# Altium schematic sheet Clock.SchDoc: Clocks
size A4; Author: Carlos Barreiro; Organization: Escuela Técnica Superior de Ingeniería de Sistemas Informáticos de la Universidad Politécnica de Madrid; Address1: Campus Sur de la Universidad Politécnica de Madrid; Address2: Calle de Alan Turing, s/nº; Address3: Madrid 28031; Address4: España; DocumentNumber: 12; Revision: A; SheetNumber: 12; SheetTotal: 16
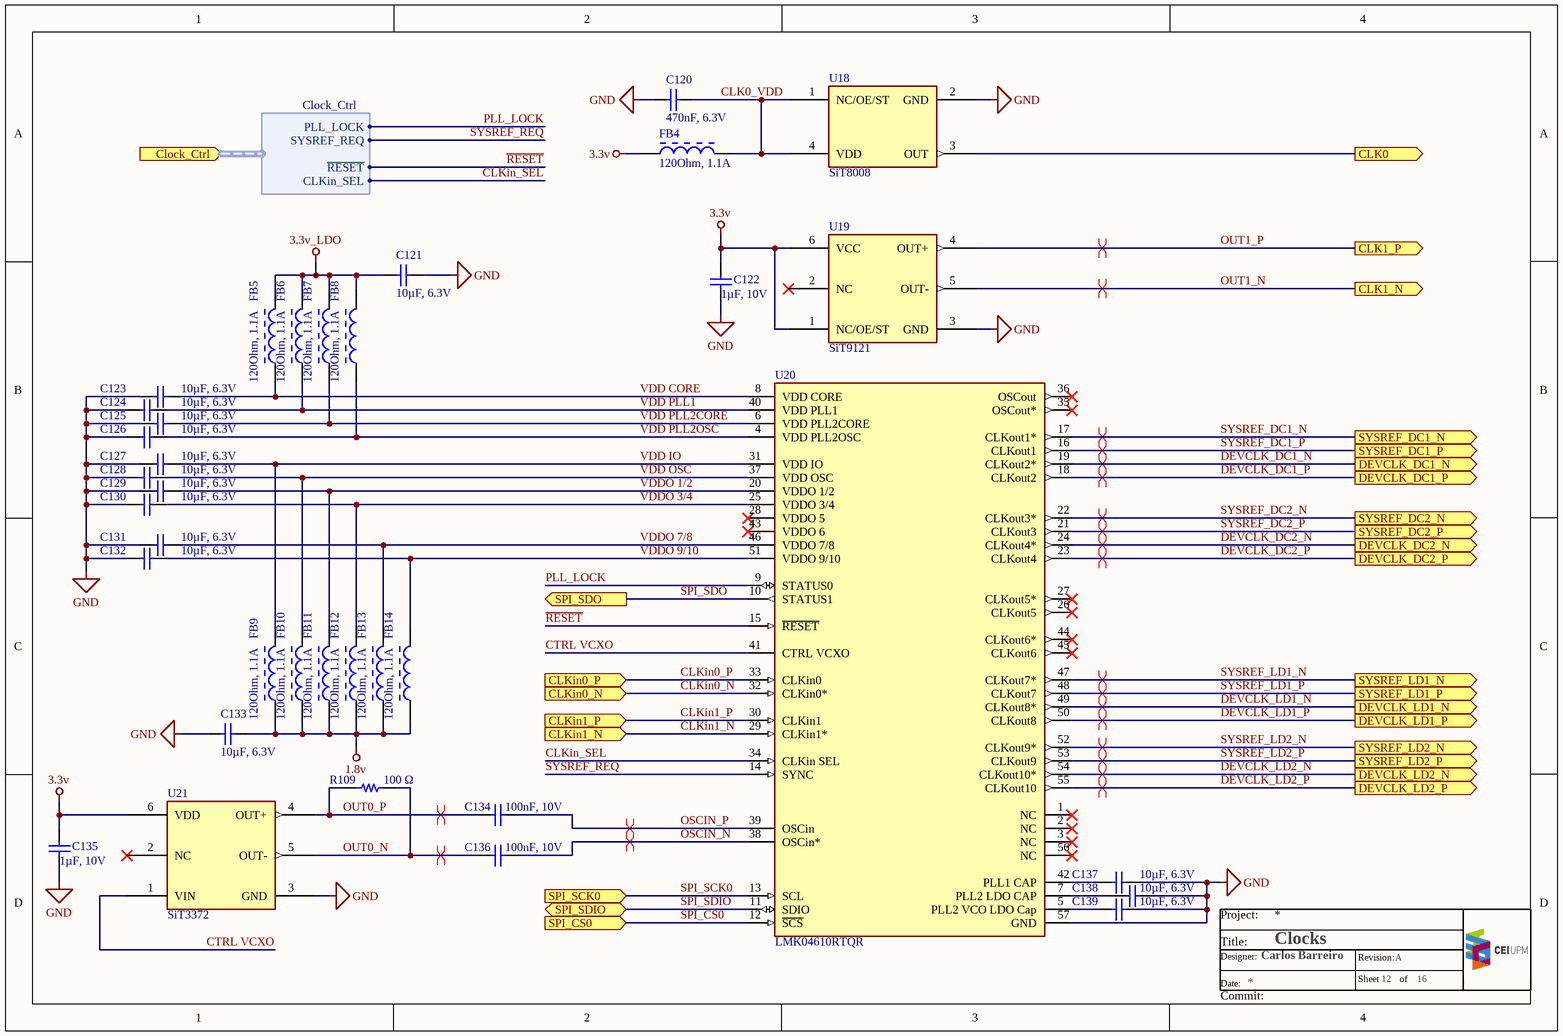
[diagram p0: Clock.SchDoc]

## Parts
C120  470nF, 6.3V  [WURTH_WCAP-CSGP_0402]
C121  10µF, 6.3V  [WURTH_WCAP-CSGP_0402]
C122  1µF, 10V  [WURTH_WCAP-CSGP_0402]
C123  10µF, 6.3V  [WURTH_WCAP-CSGP_0402]
C124  10µF, 6.3V  [WURTH_WCAP-CSGP_0402]
C125  10µF, 6.3V  [WURTH_WCAP-CSGP_0402]
C126  10µF, 6.3V  [WURTH_WCAP-CSGP_0402]
C127  10µF, 6.3V  [WURTH_WCAP-CSGP_0402]
C128  10µF, 6.3V  [WURTH_WCAP-CSGP_0402]
C129  10µF, 6.3V  [WURTH_WCAP-CSGP_0402]
C130  10µF, 6.3V  [WURTH_WCAP-CSGP_0402]
C131  10µF, 6.3V  [WURTH_WCAP-CSGP_0402]
C132  10µF, 6.3V  [WURTH_WCAP-CSGP_0402]
C133  10µF, 6.3V  [WURTH_WCAP-CSGP_0402]
C134  100nF, 10V  [WURTH_WCAP-CSGP_0402]
C135  1µF, 10V  [WURTH_WCAP-CSGP_0402]
C136  100nF, 10V  [WURTH_WCAP-CSGP_0402]
C137  10µF, 6.3V  [WURTH_WCAP-CSGP_0402]
C138  10µF, 6.3V  [WURTH_WCAP-CSGP_0402]
C139  10µF, 6.3V  [WURTH_WCAP-CSGP_0402]
FB4  120Ohm, 1.1A  [WURTH-CBF_0402]
FB5  120Ohm, 1.1A  [WURTH-CBF_0402]
FB6  120Ohm, 1.1A  [WURTH-CBF_0402]
FB7  120Ohm, 1.1A  [WURTH-CBF_0402]
FB8  120Ohm, 1.1A  [WURTH-CBF_0402]
FB9  120Ohm, 1.1A  [WURTH-CBF_0402]
FB10  120Ohm, 1.1A  [WURTH-CBF_0402]
FB11  120Ohm, 1.1A  [WURTH-CBF_0402]
FB12  120Ohm, 1.1A  [WURTH-CBF_0402]
FB13  120Ohm, 1.1A  [WURTH-CBF_0402]
FB14  120Ohm, 1.1A  [WURTH-CBF_0402]
R109  100 Ω  [PANASONIC_ERJ2G_0402]
U18  SiT8008  [SiTime_5032_4]
U19  SiT9121  [SiTime_5032_6]
U20  LMK04610RTQR  [TEXAS_VQFN56]
U21  SiT3372  [SiTime_5032_6]

## Ports
CLK0 (out), CLK1_N (out), CLK1_P (out), CLKin0_N (in), CLKin0_P (in), CLKin1_N (in), CLKin1_P (in), Clock_Ctrl (in, harness Clock_Ctrl), DEVCLK_DC1_N (out), DEVCLK_DC1_P (out), DEVCLK_DC2_N (out), DEVCLK_DC2_P (out), DEVCLK_LD1_N (out), DEVCLK_LD1_P (out), DEVCLK_LD2_N (out), DEVCLK_LD2_P (out), SPI_CS0 (in), SPI_SCK0 (in), SPI_SDIO (bidir), SPI_SDO (out), SYSREF_DC1_N (out), SYSREF_DC1_P (out), SYSREF_DC2_N (out), SYSREF_DC2_P (out), SYSREF_LD1_N (out), SYSREF_LD1_P (out), SYSREF_LD2_N (out), SYSREF_LD2_P (out)

## Harnesses
Clock_Ctrl: PLL_LOCK, SYSREF_REQ, ~{RESET}, CLKin_SEL

## Nets
1.8v: C133.2 FB9.2 FB10.2 FB11.2 FB12.2 FB13.2 FB14.2
3.3v: C122.2 C135.2 FB4.2 U19.1(NC/OE/ST) U19.6(VCC) U21.6(VDD)
3.3v_LDO: C121.1 FB5.1 FB6.1 FB7.1 FB8.1
GND: C120.1 C121.2 C122.1 C123.1 C124.1 C125.1 C126.1 C127.1 C128.1 C129.1 C130.1 C131.1 C132.1 C133.1 C135.1 C137.2 C138.2 C139.2 U18.2(GND) U19.3(GND) U20.57(GND) U21.3(GND)
CLK0: U18.3(OUT) ; port CLK0
CLK0_VDD: C120.2 FB4.1 U18.1(NC/OE/ST) U18.4(VDD)
CLKin0_N: U20.32(CLKin0*) ; port CLKin0_N
CLKin0_P: U20.33(CLKin0) ; port CLKin0_P
CLKin1_N: U20.29(CLKin1*) ; port CLKin1_N
CLKin1_P: U20.30(CLKin1) ; port CLKin1_P
CLKin_SEL: U20.34(CLKin_SEL) ; port Clock_Ctrl.CLKin_SEL
CTRL VCXO: U20.41(CTRL_VCXO) U21.1(VIN)
DEVCLK_DC1_N: U20.19(CLKout2*) ; port DEVCLK_DC1_N
DEVCLK_DC1_P: U20.18(CLKout2) ; port DEVCLK_DC1_P
DEVCLK_DC2_N: U20.24(CLKout4*) ; port DEVCLK_DC2_N
DEVCLK_DC2_P: U20.23(CLKout4) ; port DEVCLK_DC2_P
DEVCLK_LD1_N: U20.49(CLKout8*) ; port DEVCLK_LD1_N
DEVCLK_LD1_P: U20.50(CLKout8) ; port DEVCLK_LD1_P
DEVCLK_LD2_N: U20.54(CLKout10*) ; port DEVCLK_LD2_N
DEVCLK_LD2_P: U20.55(CLKout10) ; port DEVCLK_LD2_P
OSCIN_N: C136.2 U20.38(OSCin*)
OSCIN_P: C134.2 U20.39(OSCin)
OUT0_N: C136.1 R109.2 U21.5(OUT-)
OUT0_P: C134.1 R109.1 U21.4(OUT+)
OUT1_N: U19.5(OUT-) ; port CLK1_N
OUT1_P: U19.4(OUT+) ; port CLK1_P
PLL_LOCK: U20.9(STATUS0) ; port Clock_Ctrl.PLL_LOCK
~{RESET}: U20.15(~{RESET}) ; port Clock_Ctrl.~{RESET}
SPI_CS0: U20.12(~{SCS}) ; port SPI_CS0
SPI_SCK0: U20.13(SCL) ; port SPI_SCK0
SPI_SDIO: U20.11(SDIO) ; port SPI_SDIO
SPI_SDO: U20.10(STATUS1) ; port SPI_SDO
SYSREF_DC1_N: U20.17(CLKout1*) ; port SYSREF_DC1_N
SYSREF_DC1_P: U20.16(CLKout1) ; port SYSREF_DC1_P
SYSREF_DC2_N: U20.22(CLKout3*) ; port SYSREF_DC2_N
SYSREF_DC2_P: U20.21(CLKout3) ; port SYSREF_DC2_P
SYSREF_LD1_N: U20.47(CLKout7*) ; port SYSREF_LD1_N
SYSREF_LD1_P: U20.48(CLKout7) ; port SYSREF_LD1_P
SYSREF_LD2_N: U20.52(CLKout9*) ; port SYSREF_LD2_N
SYSREF_LD2_P: U20.53(CLKout9) ; port SYSREF_LD2_P
SYSREF_REQ: U20.14(SYNC) ; port Clock_Ctrl.SYSREF_REQ
VDD CORE: C123.2 FB5.2 U20.8(VDD_CORE)
VDD IO: C127.2 FB9.1 U20.31(VDD_IO)
VDD OSC: C128.2 FB10.1 U20.37(VDD_OSC)
VDD PLL1: C124.2 FB6.2 U20.40(VDD_PLL1)
VDD PLL2CORE: C125.2 FB7.2 U20.6(VDD_PLL2CORE)
VDD PLL2OSC: C126.2 FB8.2 U20.4(VDD_PLL2OSC)
VDDO 1/2: C129.2 FB11.1 U20.20(VDDO_1/2)
VDDO 3/4: C130.2 FB12.1 U20.25(VDDO_3/4)
VDDO 7/8: C131.2 FB13.1 U20.46(VDDO_7/8)
VDDO 9/10: C132.2 FB14.1 U20.51(VDDO_9/10)
NetC137_1: C137.1 U20.42(PLL1_CAP)
NetC138_1: C138.1 U20.7(PLL2_LDO_CAP)
NetC139_1: C139.1 U20.5(PLL2_VCO_LDO_Cap)

Not connected (* = marked no-connect by the designer): U19 2(NC)*; U20 1(NC)* 2(NC)* 3(NC)* 26(CLKout5)* 27(CLKout5*)* 28(VDDO_5)* 35(OSCout*)* 36(OSCout)* 43(VDDO_6)* 44(CLKout6*)* 45(CLKout6)* 56(NC)*; U21 2(NC)*

## Layout directives
differential pair: DEVCLK_DC1_N, DEVCLK_DC1_P, DEVCLK_DC2_N, DEVCLK_DC2_P, DEVCLK_LD1_N, DEVCLK_LD1_P, DEVCLK_LD2_N, DEVCLK_LD2_P, OSCIN_N, OSCIN_P, OUT0_N, OUT0_P, OUT1_N, OUT1_P, SYSREF_DC1_N, SYSREF_DC1_P, SYSREF_DC2_N, SYSREF_DC2_P, SYSREF_LD1_N, SYSREF_LD1_P, SYSREF_LD2_N, SYSREF_LD2_P

## Notes on the sheet
- Project:
- Title:
- Date:
- Designer:
- Sheet
- Revision:
- of
- Commit:

## Library data of the parts
C120 = 885012105004: WCAP-CSGP Multilayer Ceramic Chip Capacitor, General Purpose, size 0402, X5R, 470nF, 6.3V; Manufacturer: Wurth Elektronik; Rated Voltage: 6.3VDC; Isolation Resistance  min.: 0.2GOhm; Capacitance Tolerance: +/-20%; Dissipation Factor max.: 10%; Technical Reference: X5R0402474M6R3DFCT10000; ComponentLink1Description: Manufacturer; ComponentLink1URL: http://www.we-online.de; ComponentLink2Description: Datasheet; ComponentLink2URL: https://www.we-online.com/catalog/datasheet/885012105004.pdf; Operating Temperature: -55 to +85degC; Packaging: Tape and Reel; Manufacturer Part Number: 885012105004; Published Date: April 2021; Ceramic Type: X5R; Height: 0.5mm; Mounting Technology: SMT; Size: 0402; Capacitance: 470nF; Supplier 1: Digi-Key; Supplier 2: Mouser; Supplier Part Number 1: 732-7481-1-ND; Supplier Part Number 2: 710-885012105004
C121 C123-C133 C137-C139 = 885012105020: WCAP-CSGP Multilayer Ceramic Chip Capacitor, General Purpose, size 0402, X5R, 10uF, 6.3V; Manufacturer: Wurth Elektronik; Rated Voltage: 6.3VDC; Isolation Resistance  min.: 0.01GOhm; Capacitance Tolerance: +/20%; Dissipation Factor max.: 10%; Technical Reference: X5R0402106M6R3DFCT10000; ComponentLink1Description: Manufacturer; ComponentLink1URL: http://www.we-online.de; ComponentLink2Description: Datasheet; ComponentLink2URL: https://www.we-online.com/catalog/datasheet/885012105020.pdf; Operating Temperature: -55 to +85degC; Packaging: Tape and Reel; Manufacturer Part Number: 885012105020; Published Date: April 2021; Ceramic Type: X5R; Height: 0.5mm; Mounting Technology: SMT; Size: 0402; Capacitance: 10uF; Q-Factor min.: -
C122 C135 = 885012105012: WCAP-CSGP Multilayer Ceramic Chip Capacitor, General Purpose, size 0402, X5R, 1uF, 10V; Manufacturer: Wurth Elektronik; Rated Voltage: 10VDC; Isolation Resistance  min.: 0.05GOhm; Capacitance Tolerance: +/-20%; Dissipation Factor max.: 15%; Technical Reference: X5R0402105M010DFCT10000; ComponentLink1Description: Manufacturer; ComponentLink1URL: http://www.we-online.de; ComponentLink2Description: Datasheet; ComponentLink2URL: https://www.we-online.com/catalog/datasheet/885012105012.pdf; Operating Temperature: -55 to +85degC; Packaging: Tape and Reel; Manufacturer Part Number: 885012105012; Published Date: April 2021; Ceramic Type: X5R; Height: 0.5mm; Mounting Technology: SMT; Size: 0402; Capacitance: 1uF; Q-Factor min.: -; Supplier 1: Digi-Key; Supplier 2: Mouser; Supplier Part Number 2: 710-885012105012; Supplier Part Number 1: 732-7489-1-ND
C134 C136 = 885012205018: WCAP-CSGP Multilayer Ceramic Chip Capacitor, General Purpose, size 0402, X7R, 100nF, 10V; Manufacturer: Wurth Elektronik; Rated Voltage: 10VDC; Isolation Resistance  min.: 5GOhm; Capacitance Tolerance: +/-10%; Dissipation Factor max.: 5%; Technical Reference: X7R0402104K010DFCT10000; ComponentLink1Description: Manufacturer; ComponentLink1URL: http://www.we-online.de; ComponentLink2Description: Datasheet; ComponentLink2URL: https://www.we-online.com/catalog/datasheet/885012205018.pdf; Operating Temperature: -55 to +125degC; Packaging: Tape and Reel; Manufacturer Part Number: 885012205018; Published Date: April 2021; Ceramic Type: X7R; Height: 0.5mm; Mounting Technology: SMT; Size: 0402; Capacitance: 100nF; Q-Factor min.: -
FB4-FB14 = 74279271: WE-CBF SMT EMI Suppression Ferrite Bead, size 0402, 120Ohm, 1.1A; Manufacturer: Wurth Elektronik; Impedance max.: 200Ohm; DC Resistance max.: 0.2Ohm; Type: Wide Band; ComponentLink1Description: Manufacturer; ComponentLink1URL: http://www.we-online.de; ComponentLink2Description: Datasheet; ComponentLink2URL: https://www.we-online.com/catalog/datasheet/74279271.pdf; Operating Temperature: -55 to +125degC; Packaging: Tape and Reel; Published Date: December 2021; Rated Current: 1.1A; Manufacturer Part Number: 74279271; Impedance @100MHz: 120Ohm; Mounting Technology: SMT; Size: 0402; Height: 0.5mm; Length: 1mm; Width: 0.5mm
R109 = ERJ2GEJ101X: General Purpose Thick Film Chip Resistors; Manufacturer: Panasonic; Power (0402): 0.1 W; Limiting Voltage (0402): 50; Maximum Voltage (0402): 100; Resistance Range (Ω): 1Ω to 100MΩ; AEC 200: Grade 0; Size (0402): 2GE; ComponentLink1Description: Catalog; ComponentLink1URL: https://industrial.panasonic.com/ww/products/pt/general-purpose-chip-resistors/models?op=search&model_status_current=1&page=0#model-list-search-results; Series: ERJ; Temperature Range (ºC): -55 to +155; Supplier 1: Digi-Key; Supplier 2: Mouser; Supplier Part Number 2: 667-ERJ-2GEJ101X; Supplier Part Number 1: P100JTR-ND
U18 = SiT8008: Programmable oscillator, featuring wide frequency range, low power consumption, small size and excellent stability.; Frequency: 1 to 110 MHz; Frequency Stability (ppm): ±20, ±25, ±50; Phase Jitter (rms): 1.3 ps; Output Type: LVCMOS; Voltage Supply (V): 1.8V to 3.3V; Package Type (mm²): 5.0x3.2; Operating Temperature Range (°C): -40ºC to +85ºC; ComponentLink1Description: Manufacturer; ComponentLink1URL: https://www.sitime.com/products/lvcmos-oscillators/sit8008; Supplier 1: Mouser; Supplier Part Number 1: 788-8008BI2333S1000G
U19 = SiT9121: Programmable differential oscillator that supports LVPECL and LVDS output.; Oscillator Type: XO-DE; Frequency: 1 to 220 MHz; Frequency Stability (ppm): ±10, ±20, ±25, ±50; Phase Jitter (rms): 0.6 ps; Output Type: LVPECL, LVDS; Voltage Supply (V): 2.25V to 3.63V; Package Type (mm²): 5.0x3.2; Operating Temperature Range (°C): -40ºC to +85ºC; ComponentLink1Description: Manufacturer; ComponentLink1URL: https://www.sitime.com/products/lvpecl-lvds-hcsl-oscillators/sit9121; Supplier 1: Digi-Key; Supplier 2: Avnet; Supplier Part Number 1: 1473-SIT9121AI-2B3-XXS200.000000YTR-ND; Supplier Part Number 2: SIT9121AI-2B3-XXS200.000000Y
U20 = LMK04610RTQR: Ultra low-noise and low power JESD204B compliant clock jitter cleaner with dual PLLs.; Number of outputs: 10; RMS jitter (fs): 65; Output frequency (Min) (MHz): 0.03; Output frequency (Max) (MHz): 2000; Function: Dual-loop PLL; Input type: LVCMOS, LVDS, LVPECL; Output type: LVDS, LVPECL; Supply voltage (Min) (V): 1.7; Supply voltage (Max) (V): 3.465; ComponentLink1Description: Manufacturer; ComponentLink1URL: https://www.ti.com/product/LMK04828; ComponentLink2Description: Datasheet; ComponentLink2URL: https://www.ti.com/lit/ds/symlink/lmk04828.pdf?ts=1643235840450&ref_url=https%253A%252F%252Fwww.ti.com%252Fproduct%252FLMK04828; ComponentLink3Description: Package Specification; ComponentLink3URL: https://www.ti.com/lit/ml/mpqs032a/mpqs032a.pdf?ts=1643290177634&ref_url=https%253A%252F%252Fwww.ti.com%252Fpackaging%252Fdocs%252Fsearchproductbypackage.tsp%253ForderablePartNumber%253D%2526packageDesignator%253DNKD%2526pinCount%253D64%2526results%253Dresults; Operating temperature range (ºC): -40ºC to 85ºC; Supplier 1: Digi-Key; Supplier 2: Digi-Key; Supplier Part Number 1: 296-51339-1-ND; Supplier Part Number 2: 296-51339-6-ND
U21 = SiT3372: Ultra-low Jitter Differential VCXO.; Oscillator Type: VCXO-DE; Frequency: 1 to 220 MHz; Frequency Stability (ppm): ±15, ±25, ±30, ±50; Phase Jitter (rms): 0.21 ps; Output Type: LVPECL, LVDS, HCSL; Voltage Supply (V): 2.5, 2.8, 3.0, 3.3; Package Type (mm²): 5.0x3.2; Operating Temperature Range (°C): -40ºC to +85ºC; ComponentLink1Description: Manufacturer; ComponentLink1URL: https://www.sitime.com/products/lvpecl-lvds-hcsl-oscillators/sit9121; Supplier 1: Digi-Key; Supplier Part Number 1: 1473-SIT3372AI-1B3-33NZ25.000000-ND